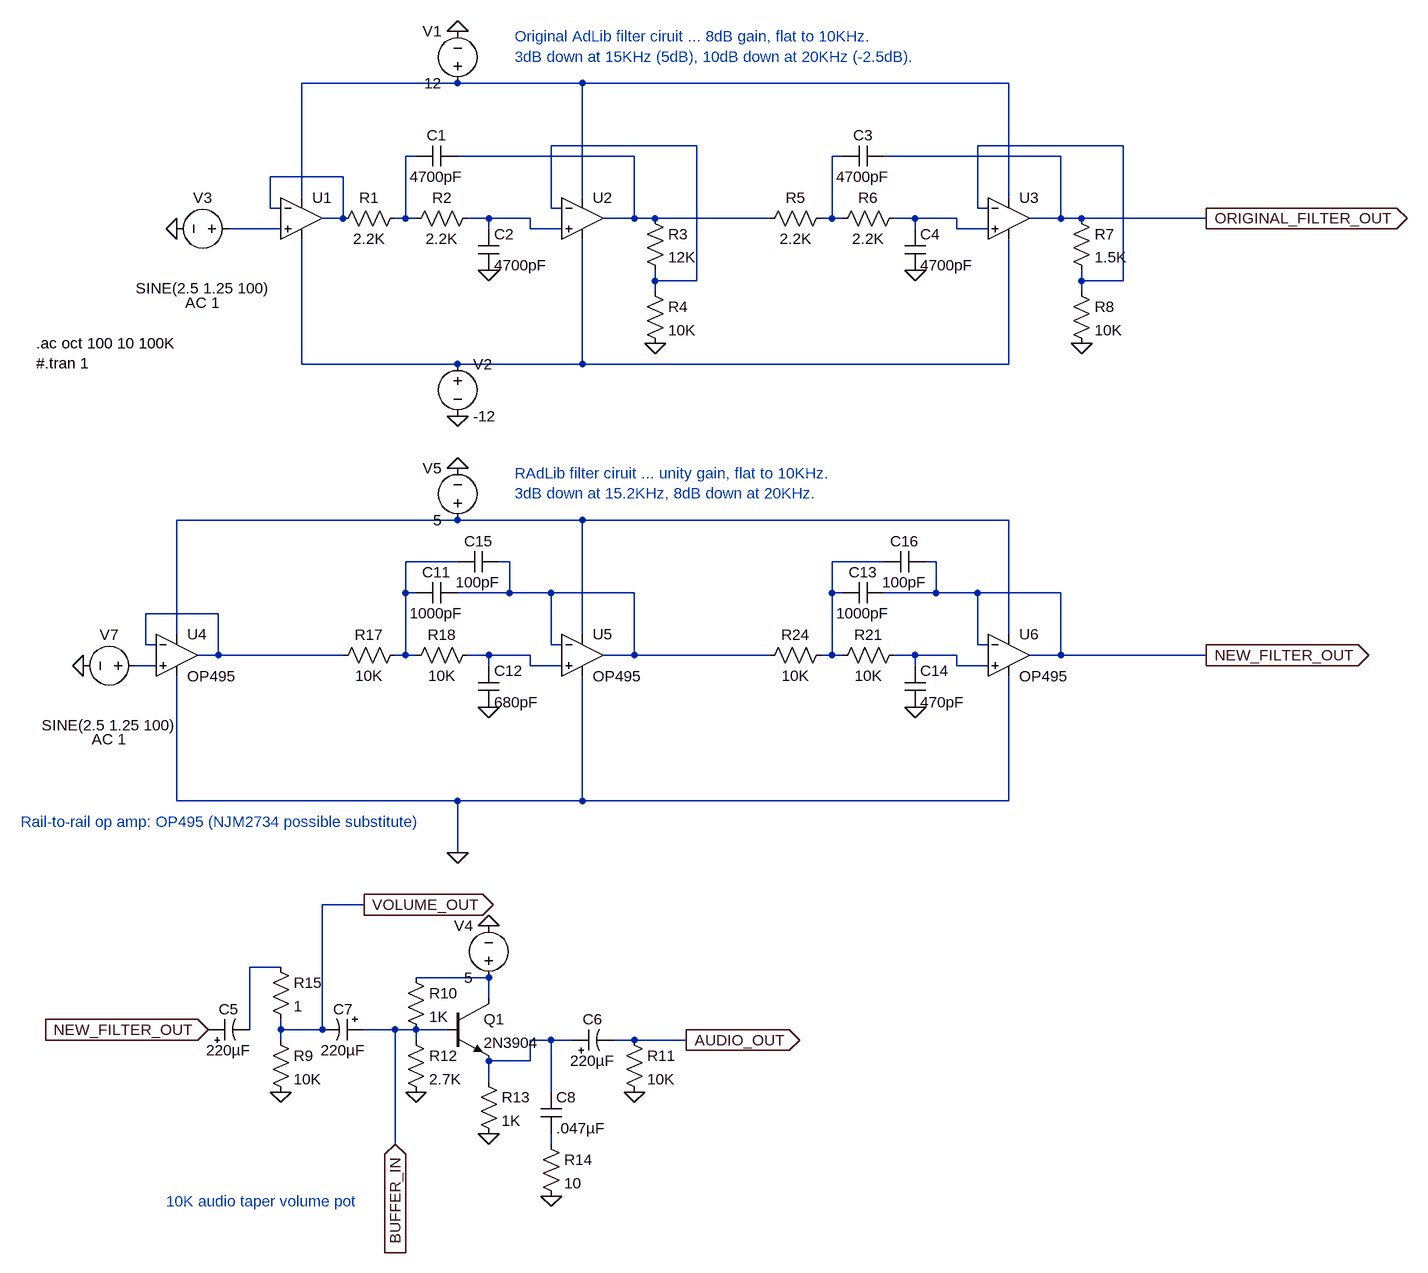
[diagram p0: schematic Analog_Section_Sim.asc]
Analog_Section_Sim.asc, the LTspice schematic file:
Version 4
SHEET 1 1840 2144
WIRE 336 112 96 112
WIRE 528 112 336 112
WIRE 1184 112 528 112
WIRE 704 208 480 208
WIRE 1360 208 1136 208
WIRE 272 224 256 224
WIRE 608 224 336 224
WIRE 928 224 912 224
WIRE 1264 224 992 224
WIRE 160 256 48 256
WIRE 96 288 96 112
WIRE 528 288 528 112
WIRE 1184 288 1184 112
WIRE 48 304 48 256
WIRE 64 304 48 304
WIRE 480 304 480 208
WIRE 496 304 480 304
WIRE 1136 304 1136 208
WIRE 1152 304 1136 304
WIRE 160 320 160 256
WIRE 160 320 128 320
WIRE 256 320 256 224
WIRE 256 320 240 320
WIRE 272 320 256 320
WIRE 384 320 352 320
WIRE 448 320 384 320
WIRE 608 320 608 224
WIRE 608 320 560 320
WIRE 640 320 608 320
WIRE 816 320 640 320
WIRE 912 320 912 224
WIRE 912 320 896 320
WIRE 928 320 912 320
WIRE 1040 320 1008 320
WIRE 1104 320 1040 320
WIRE 1264 320 1264 224
WIRE 1264 320 1216 320
WIRE 1296 320 1264 320
WIRE 1488 320 1296 320
WIRE 64 336 -16 336
WIRE 384 336 384 320
WIRE 448 336 448 320
WIRE 496 336 448 336
WIRE 1040 336 1040 320
WIRE 1104 336 1104 320
WIRE 1152 336 1104 336
WIRE 640 416 640 400
WIRE 704 416 704 208
WIRE 704 416 640 416
WIRE 1296 416 1296 400
WIRE 1360 416 1360 208
WIRE 1360 416 1296 416
WIRE 640 432 640 416
WIRE 1296 432 1296 416
WIRE 96 544 96 352
WIRE 336 544 96 544
WIRE 528 544 528 352
WIRE 528 544 336 544
WIRE 1184 544 1184 352
WIRE 1184 544 528 544
WIRE 336 784 -96 784
WIRE 528 784 336 784
WIRE 1184 784 528 784
WIRE 336 848 256 848
WIRE 416 848 400 848
WIRE 992 848 912 848
WIRE 1072 848 1056 848
WIRE 256 896 256 848
WIRE 272 896 256 896
WIRE 416 896 416 848
WIRE 416 896 336 896
WIRE 480 896 416 896
WIRE 608 896 480 896
WIRE 912 896 912 848
WIRE 928 896 912 896
WIRE 1072 896 1072 848
WIRE 1072 896 992 896
WIRE 1136 896 1072 896
WIRE 1264 896 1136 896
WIRE -32 928 -144 928
WIRE -96 960 -96 784
WIRE 528 960 528 784
WIRE 1184 960 1184 784
WIRE -144 976 -144 928
WIRE -128 976 -144 976
WIRE 480 976 480 896
WIRE 496 976 480 976
WIRE 1136 976 1136 896
WIRE 1152 976 1136 976
WIRE -32 992 -32 928
WIRE -32 992 -64 992
WIRE 160 992 -32 992
WIRE 256 992 256 896
WIRE 256 992 240 992
WIRE 272 992 256 992
WIRE 384 992 352 992
WIRE 448 992 384 992
WIRE 608 992 608 896
WIRE 608 992 560 992
WIRE 816 992 608 992
WIRE 912 992 912 896
WIRE 912 992 896 992
WIRE 928 992 912 992
WIRE 1040 992 1008 992
WIRE 1104 992 1040 992
WIRE 1264 992 1264 896
WIRE 1264 992 1216 992
WIRE 1488 992 1264 992
WIRE -128 1008 -160 1008
WIRE 384 1008 384 992
WIRE 448 1008 448 992
WIRE 496 1008 448 1008
WIRE 1040 1008 1040 992
WIRE 1104 1008 1104 992
WIRE 1152 1008 1104 1008
WIRE -96 1216 -96 1024
WIRE 336 1216 -96 1216
WIRE 528 1216 528 1024
WIRE 528 1216 336 1216
WIRE 1184 1216 1184 1024
WIRE 1184 1216 528 1216
WIRE 336 1296 336 1216
WIRE 192 1376 128 1376
WIRE 64 1472 16 1472
WIRE 384 1488 272 1488
WIRE 384 1520 384 1488
WIRE 16 1568 16 1472
WIRE 64 1568 64 1552
WIRE 128 1568 128 1376
WIRE 128 1568 64 1568
WIRE 240 1568 192 1568
WIRE 272 1568 240 1568
WIRE 320 1568 272 1568
WIRE 64 1584 64 1568
WIRE 272 1584 272 1568
WIRE 480 1584 448 1584
WIRE 512 1584 480 1584
WIRE 608 1584 576 1584
WIRE 688 1584 608 1584
WIRE 448 1616 448 1584
WIRE 448 1616 384 1616
WIRE 384 1648 384 1616
WIRE 480 1664 480 1584
WIRE 240 1744 240 1568
WIRE 480 1744 480 1728
FLAG 384 400 0
FLAG 640 512 0
FLAG 336 32 0
FLAG 336 624 0
FLAG -96 336 0
FLAG 1040 400 0
FLAG 1296 512 0
FLAG 1488 320 ORIGINAL_FILTER_OUT
IOPIN 1488 320 Out
FLAG 384 1072 0
FLAG 336 704 0
FLAG 336 1296 0
FLAG -240 1008 0
FLAG 1040 1072 0
FLAG 1488 992 NEW_FILTER_OUT
IOPIN 1488 992 Out
FLAG -48 1568 NEW_FILTER_OUT
IOPIN -48 1568 In
FLAG 64 1664 0
FLAG 688 1584 AUDIO_OUT
IOPIN 688 1584 Out
FLAG 384 1408 0
FLAG 608 1664 0
FLAG 272 1664 0
FLAG 384 1728 0
FLAG 240 1744 BUFFER_IN
IOPIN 240 1744 In
FLAG 192 1376 VOLUME_OUT
IOPIN 192 1376 Out
FLAG 480 1824 0
SYMBOL voltage 336 128 R180
WINDOW 0 24 96 Left 2
WINDOW 3 24 16 Left 2
SYMATTR InstName V1
SYMATTR Value 12
SYMBOL voltage 336 528 R0
SYMATTR InstName V2
SYMATTR Value -12
SYMBOL res 256 304 R90
WINDOW 0 0 56 VBottom 2
WINDOW 3 32 56 VTop 2
SYMATTR InstName R1
SYMATTR Value 2.2K
SYMBOL res 368 304 R90
WINDOW 0 0 56 VBottom 2
WINDOW 3 32 56 VTop 2
SYMATTR InstName R2
SYMATTR Value 2.2K
SYMBOL cap 336 208 R90
WINDOW 0 0 32 VBottom 2
WINDOW 3 32 32 VTop 2
SYMATTR InstName C1
SYMATTR Value 4700pF
SYMBOL cap 368 336 R0
SYMATTR InstName C2
SYMATTR Value 4700pF
SYMBOL res 624 304 R0
SYMATTR InstName R3
SYMATTR Value 12K
SYMBOL res 624 416 R0
SYMATTR InstName R4
SYMATTR Value 10K
SYMBOL voltage 0 336 R90
WINDOW 0 -32 56 VBottom 2
WINDOW 3 76 56 VTop 2
WINDOW 123 98 56 VTop 2
SYMATTR InstName V3
SYMATTR Value SINE(2.5 1.25 100)
SYMATTR Value2 AC 1
SYMBOL res 1024 304 R90
WINDOW 0 0 56 VBottom 2
WINDOW 3 32 56 VTop 2
SYMATTR InstName R6
SYMATTR Value 2.2K
SYMBOL cap 992 208 R90
WINDOW 0 0 32 VBottom 2
WINDOW 3 32 32 VTop 2
SYMATTR InstName C3
SYMATTR Value 4700pF
SYMBOL cap 1024 336 R0
SYMATTR InstName C4
SYMATTR Value 4700pF
SYMBOL res 1280 304 R0
SYMATTR InstName R7
SYMATTR Value 1.5K
SYMBOL res 1280 416 R0
SYMATTR InstName R8
SYMATTR Value 10K
SYMBOL res 912 304 R90
WINDOW 0 0 56 VBottom 2
WINDOW 3 32 56 VTop 2
SYMATTR InstName R5
SYMATTR Value 2.2K
SYMBOL voltage 336 800 R180
WINDOW 0 24 96 Left 2
WINDOW 3 24 16 Left 2
SYMATTR InstName V5
SYMATTR Value 5
SYMBOL res 256 976 R90
WINDOW 0 0 56 VBottom 2
WINDOW 3 32 56 VTop 2
SYMATTR InstName R17
SYMATTR Value 10K
SYMBOL res 368 976 R90
WINDOW 0 0 56 VBottom 2
WINDOW 3 32 56 VTop 2
SYMATTR InstName R18
SYMATTR Value 10K
SYMBOL cap 336 880 R90
WINDOW 0 0 32 VBottom 2
WINDOW 3 32 32 VTop 2
SYMATTR InstName C11
SYMATTR Value 1000pF
SYMBOL cap 368 1008 R0
SYMATTR InstName C12
SYMATTR Value 680pF
SYMBOL voltage -144 1008 R90
WINDOW 0 -32 56 VBottom 2
WINDOW 3 76 56 VTop 2
WINDOW 123 98 56 VTop 2
SYMATTR InstName V7
SYMATTR Value SINE(2.5 1.25 100)
SYMATTR Value2 AC 1
SYMBOL res 1024 976 R90
WINDOW 0 0 56 VBottom 2
WINDOW 3 32 56 VTop 2
SYMATTR InstName R21
SYMATTR Value 10K
SYMBOL cap 992 880 R90
WINDOW 0 0 32 VBottom 2
WINDOW 3 32 32 VTop 2
SYMATTR InstName C13
SYMATTR Value 1000pF
SYMBOL cap 1024 1008 R0
SYMATTR InstName C14
SYMATTR Value 470pF
SYMBOL res 912 976 R90
WINDOW 0 0 56 VBottom 2
WINDOW 3 32 56 VTop 2
SYMATTR InstName R24
SYMATTR Value 10K
SYMBOL cap 400 832 R90
WINDOW 0 0 32 VBottom 2
WINDOW 3 32 32 VTop 2
SYMATTR InstName C15
SYMATTR Value 100pF
SYMBOL cap 1056 832 R90
WINDOW 0 0 32 VBottom 2
WINDOW 3 32 32 VTop 2
SYMATTR InstName C16
SYMATTR Value 100pF
SYMBOL Opamps/OP495 -96 928 R0
SYMATTR InstName U4
SYMBOL Opamps/OP495 528 928 R0
SYMATTR InstName U5
SYMBOL Opamps/OP495 1184 928 R0
SYMATTR InstName U6
SYMBOL Opamps/UniversalOpamp2 96 320 R0
SYMATTR InstName U1
SYMBOL Opamps/UniversalOpamp2 528 320 R0
SYMATTR InstName U2
SYMBOL Opamps/UniversalOpamp2 1184 320 R0
SYMATTR InstName U3
SYMBOL polcap -48 1584 R270
WINDOW 0 32 32 VTop 2
WINDOW 3 0 32 VBottom 2
SYMATTR InstName C5
SYMATTR Value 220µF
SYMBOL res 48 1568 R0
SYMATTR InstName R9
SYMATTR Value 10K
SYMBOL polcap 512 1600 R270
WINDOW 0 32 32 VTop 2
WINDOW 3 0 32 VBottom 2
SYMATTR InstName C6
SYMATTR Value 220µF
SYMBOL voltage 384 1504 R180
WINDOW 0 24 96 Left 2
WINDOW 3 24 16 Left 2
SYMATTR InstName V4
SYMATTR Value 5
SYMBOL res 592 1568 R0
SYMATTR InstName R11
SYMATTR Value 10K
SYMBOL npn 320 1520 R0
SYMATTR InstName Q1
SYMATTR Value 2N3904
SYMBOL res 256 1472 R0
SYMATTR InstName R10
SYMATTR Value 1K
SYMBOL res 256 1568 R0
SYMATTR InstName R12
SYMATTR Value 2.7K
SYMBOL res 368 1632 R0
SYMATTR InstName R13
SYMATTR Value 1K
SYMBOL polcap 192 1552 R90
WINDOW 0 0 32 VBottom 2
WINDOW 3 32 32 VTop 2
SYMATTR InstName C7
SYMATTR Value 220µF
SYMBOL res 464 1728 R0
SYMATTR InstName R14
SYMATTR Value 10
SYMBOL cap 464 1664 R0
SYMATTR InstName C8
SYMATTR Value .047µF
SYMBOL res 48 1456 R0
SYMATTR InstName R15
SYMATTR Value 1
TEXT -312 512 Left 2 !.ac oct 100 10 100K\n#.tran 1
TEXT 424 40 Left 2 ;Original AdLib filter ciruit ... 8dB gain, flat to 10KHz.\n3dB down at 15KHz (5dB), 10dB down at 20KHz (-2.5dB).
TEXT 424 712 Left 2 ;RAdLib filter ciruit ... unity gain, flat to 10KHz.\n3dB down at 15.2KHz, 8dB down at 20KHz.
TEXT -336 1248 Left 2 ;Rail-to-rail op amp: OP495 (NJM2734 possible substitute)
TEXT -112 1832 Left 2 ;10K audio taper volume pot

The netlist it stands for:
* Analog_Section_Sim.asc
V1 N001 0 12
V2 N011 0 -12
R1 N004 N007 2.2K
R2 N008 N004 2.2K
C1 N005 N004 4700pF
C2 N008 0 4700pF
R3 N005 N002 12K
R4 N002 0 10K
V3 N010 0 SINE(2.5 1.25 100) AC 1
R6 N009 N006 2.2K
C3 ORIGINAL_FILTER_OUT N006 4700pF
C4 N009 0 4700pF
R7 ORIGINAL_FILTER_OUT N003 1.5K
R8 N003 0 10K
R5 N006 N005 2.2K
V5 N012 0 5
R17 N013 N016 10K
R18 N017 N013 10K
C11 N014 N013 1000pF
C12 N017 0 680pF
V7 N019 0 SINE(2.5 1.25 100) AC 1
R21 N018 N015 10K
C13 NEW_FILTER_OUT N015 1000pF
C14 N018 0 470pF
R24 N015 N014 10K
C15 N014 N013 100pF
C16 NEW_FILTER_OUT N015 100pF
XU4 N019 N016 N012 0 N016 OP495  ; pins In+ In- V+ V- OUT
XU5 N017 N014 N012 0 N014 OP495  ; pins In+ In- V+ V- OUT
XU6 N018 NEW_FILTER_OUT N012 0 NEW_FILTER_OUT OP495  ; pins In+ In- V+ V- OUT
XU1 N010 N007 N001 N011 N007 level.2 Avol=1Meg GBW=10Meg Slew=10Meg ilimit=25m rail=0 Vos=0 phimargin=45 en=0 enk=0 in=0 ink=0 Rin=500Meg  ; pins IN+ IN- V+ V- OUT
XU2 N008 N002 N001 N011 N005 level.2 Avol=1Meg GBW=10Meg Slew=10Meg ilimit=25m rail=0 Vos=0 phimargin=45 en=0 enk=0 in=0 ink=0 Rin=500Meg  ; pins IN+ IN- V+ V- OUT
XU3 N009 N003 N001 N011 ORIGINAL_FILTER_OUT level.2 Avol=1Meg GBW=10Meg Slew=10Meg ilimit=25m rail=0 Vos=0 phimargin=45 en=0 enk=0 in=0 ink=0 Rin=500Meg  ; pins IN+ IN- V+ V- OUT
C5 NEW_FILTER_OUT N020 220µF
R9 VOLUME_OUT 0 10K
C6 N022 AUDIO_OUT 220µF
V4 N021 0 5
R11 AUDIO_OUT 0 10K
Q1 N021 BUFFER_IN N022 0 2N3904
R10 N021 BUFFER_IN 1K
R12 BUFFER_IN 0 2.7K
R13 N022 0 1K
C7 BUFFER_IN VOLUME_OUT 220µF
R14 N023 0 10
C8 N022 N023 .047µF
R15 N020 VOLUME_OUT 1
.model NPN NPN
.model PNP PNP
.lib standard.bjt
.ac oct 100 10 100K
#.tran 1
* Original AdLib filter ciruit ... 8dB gain, flat to 10KHz.
* 3dB down at 15KHz (5dB), 10dB down at 20KHz (-2.5dB).
* RAdLib filter ciruit ... unity gain, flat to 10KHz.
* 3dB down at 15.2KHz, 8dB down at 20KHz.
* Rail-to-rail op amp: OP495 (NJM2734 possible substitute)
* 10K audio taper volume pot
.lib UniversalOpamps2.sub
.backanno
.end